# Altium schematic sheet BBB Headers.SchDoc: BBB Headers
size OrCAD E; DocumentNumber: LM-003; Revision: 3.0; SheetNumber: 4; SheetTotal: 11
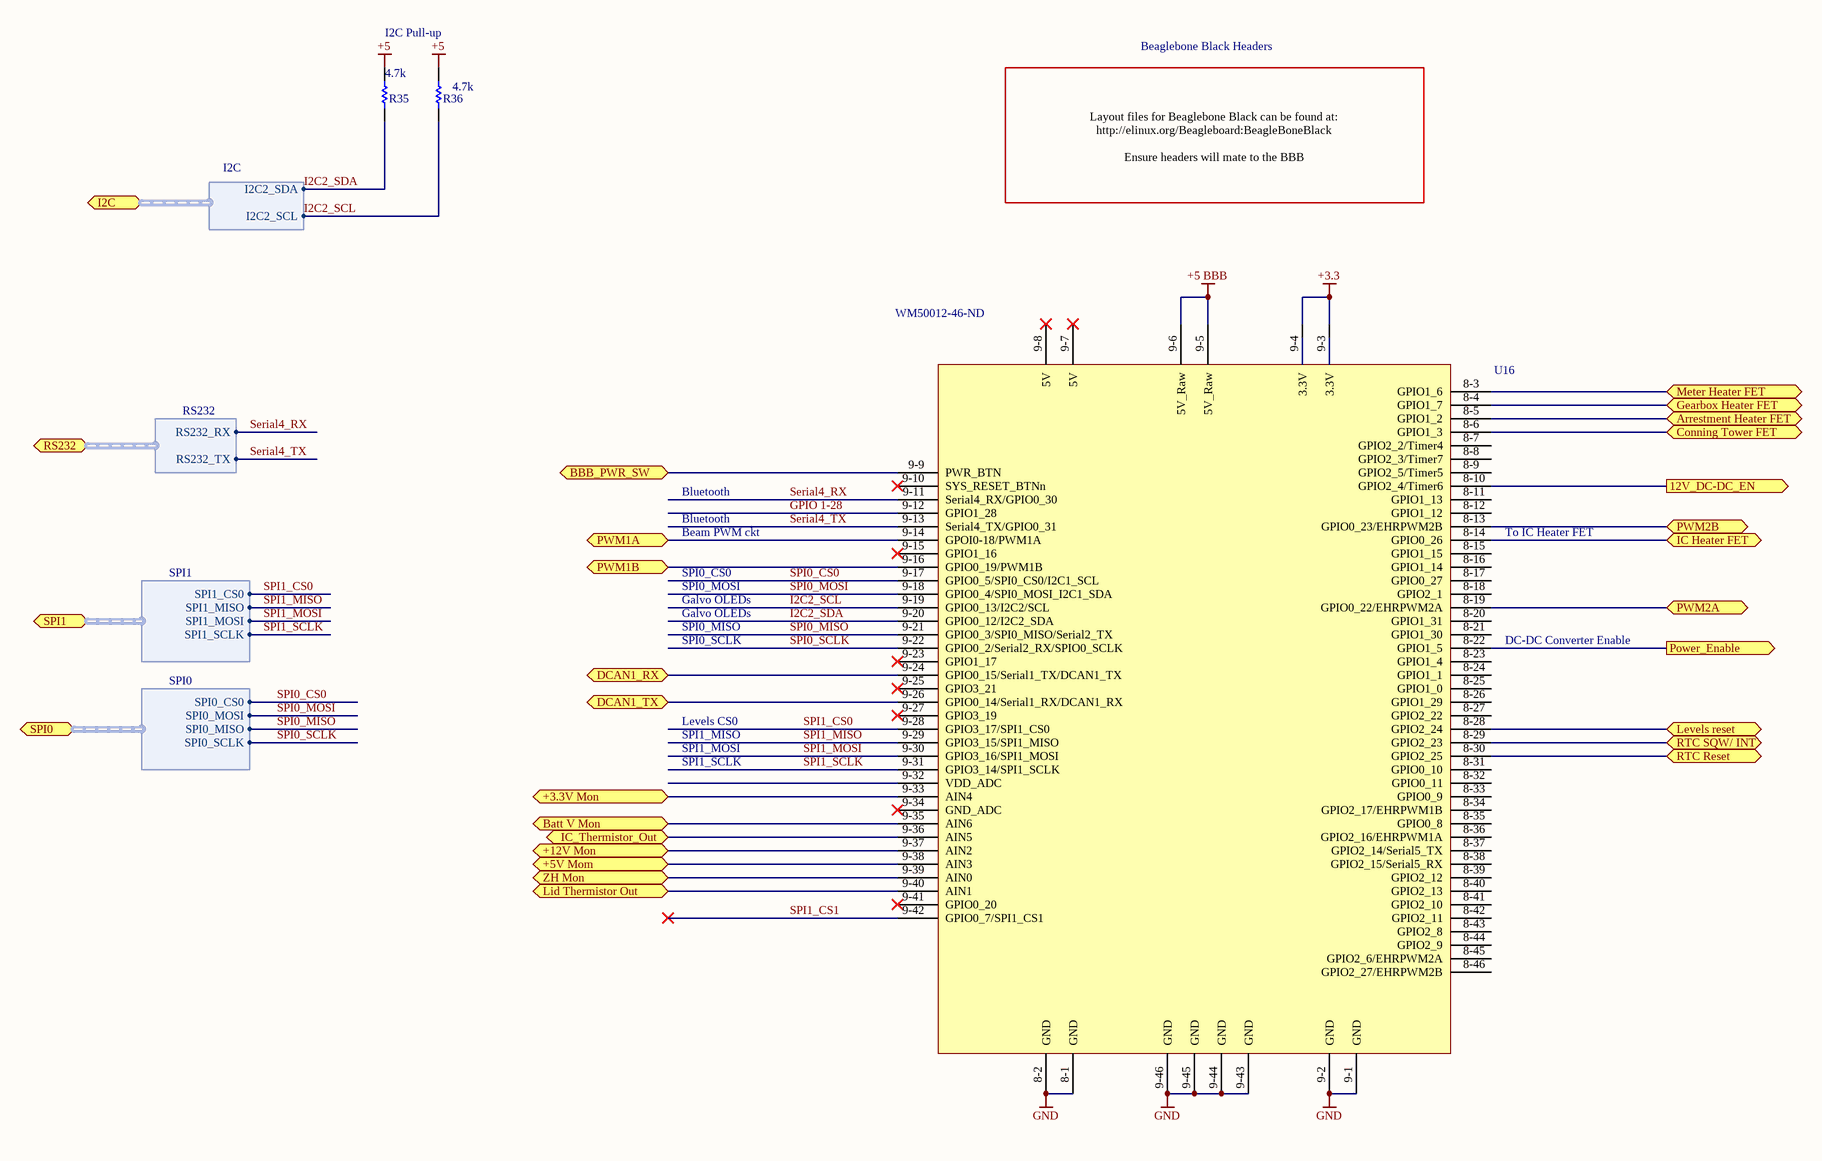
[diagram p0: BBB Headers.SchDoc]

## Parts
R35  Resistance (Ohms): 4.7k  [RESC0805(2012)_N]  (hidden comment: 3K74 0.125W 1% 0805 (2012 Metric)  SMD)
R36  Resistance (Ohms): 4.7k  [RESC0805(2012)_N]  (hidden comment: 3K74 0.125W 1% 0805 (2012 Metric)  SMD)
U16  Supplier Part Number 1: WM50012-46-ND  [Beaglebone Black]  (hidden comment: BBB)

## Ports
12V_DC-DC_EN (out), +3.3V Mon, +5V Mom, +12V Mon, Arrestment Heater FET, Batt V Mon, BBB_PWR_SW, Conning Tower FET, DCAN1_RX, DCAN1_TX, Gearbox Heater FET, I2C (harness I2C), IC Heater FET, IC_Thermistor_Out, Levels reset, Lid Thermistor Out, Meter Heater FET, Power_Enable (out), PWM1A, PWM1B, PWM2A, PWM2B, RS232 (harness RS232), RTC Reset, RTC SQW/ INT, SPI0 (harness SPI0), SPI1 (harness SPI1), ZH Mon

## Harnesses
RS232: RS232_RX, RS232_TX
I2C: I2C2_SDA, I2C2_SCL
SPI1: SPI1_CS0, SPI1_MISO, SPI1_MOSI, SPI1_SCLK
SPI0: SPI0_CS0, SPI0_MOSI, SPI0_MISO, SPI0_SCLK

## Nets
+3.3: U16.9-3(3.3V) U16.9-4(3.3V)
+5: R35.2 R36.2
+5 BBB: U16.9-5(5V_Raw) U16.9-6(5V_Raw)
GND: U16.8-1(GND) U16.8-2(GND) U16.9-1(GND) U16.9-2(GND) U16.9-43(GND) U16.9-44(GND) U16.9-45(GND) U16.9-46(GND)
12V_DC-DC_EN: U16.8-10(GPIO2_4/Timer6) ; port 12V_DC-DC_EN
+3.3V Mon: U16.9-33(AIN4) ; port +3.3V Mon
+5V Mom: U16.9-38(AIN3) ; port +5V Mom
+12V Mon: U16.9-37(AIN2) ; port +12V Mon
Arrestment Heater FET: U16.8-5(GPIO1_2) ; port Arrestment Heater FET
Batt V Mon: U16.9-35(AIN6) ; port Batt V Mon
BBB_PWR_SW: U16.9-9(PWR_BTN) ; port BBB_PWR_SW
Conning Tower FET: U16.8-6(GPIO1_3) ; port Conning Tower FET
DCAN1_RX: U16.9-24(GPIO0_15/Serial1_TX/DCAN1_TX) ; port DCAN1_RX
DCAN1_TX: U16.9-26(GPIO0_14/Serial1_RX/DCAN1_RX) ; port DCAN1_TX
Gearbox Heater FET: U16.8-4(GPIO1_7) ; port Gearbox Heater FET
GPIO 1-28: U16.9-12(GPIO1_28)
I2C2_SCL: R36.1 U16.9-19(GPIO0_13/I2C2/SCL) ; port I2C.I2C2_SCL
I2C2_SDA: R35.1 U16.9-20(GPIO0_12/I2C2_SDA) ; port I2C.I2C2_SDA
IC Heater FET: U16.8-14(GPIO0_26) ; port IC Heater FET
IC_Thermistor_Out: U16.9-36(AIN5) ; port IC_Thermistor_Out
Levels reset: U16.8-28(GPIO2_24) ; port Levels reset
Lid Thermistor Out: U16.9-40(AIN1) ; port Lid Thermistor Out
Meter Heater FET: U16.8-3(GPIO1_6) ; port Meter Heater FET
Power_Enable: U16.8-22(GPIO1_5) ; port Power_Enable
PWM1A: U16.9-14(GPOI0-18/PWM1A) ; port PWM1A
PWM1B: U16.9-16(GPIO0_19/PWM1B) ; port PWM1B
PWM2A: U16.8-19(GPIO0_22/EHRPWM2A) ; port PWM2A
PWM2B: U16.8-13(GPIO0_23/EHRPWM2B) ; port PWM2B
RTC Reset: U16.8-30(GPIO2_25) ; port RTC Reset
RTC SQW/ INT: U16.8-29(GPIO2_23) ; port RTC SQW/ INT
Serial4_RX: U16.9-11(Serial4_RX/GPIO0_30) ; port RS232.RS232_RX
Serial4_TX: U16.9-13(Serial4_TX/GPIO0_31) ; port RS232.RS232_TX
SPI0_CS0: U16.9-17(GPIO0_5/SPI0_CS0/I2C1_SCL) ; port SPI0.SPI0_CS0
SPI0_MISO: U16.9-21(GPIO0_3/SPI0_MISO/Serial2_TX) ; port SPI0.SPI0_MISO
SPI0_MOSI: U16.9-18(GPIO0_4/SPI0_MOSI_I2C1_SDA) ; port SPI0.SPI0_MOSI
SPI0_SCLK: U16.9-22(GPIO0_2/Serial2_RX/SPIO0_SCLK) ; port SPI0.SPI0_SCLK
SPI1_CS0: U16.9-28(GPIO3_17/SPI1_CS0) ; port SPI1.SPI1_CS0
SPI1_CS1: U16.9-42(GPIO0_7/SPI1_CS1)
SPI1_MISO: U16.9-29(GPIO3_15/SPI1_MISO) ; port SPI1.SPI1_MISO
SPI1_MOSI: U16.9-30(GPIO3_16/SPI1_MOSI) ; port SPI1.SPI1_MOSI
SPI1_SCLK: U16.9-31(GPIO3_14/SPI1_SCLK) ; port SPI1.SPI1_SCLK
ZH Mon: U16.9-39(AIN0) ; port ZH Mon

Not connected (* = marked no-connect by the designer): U16 8-7(GPIO2_2/Timer4) 8-8(GPIO2_3/Timer7) 8-9(GPIO2_5/Timer5) 8-11(GPIO1_13) 8-12(GPIO1_12) 8-15(GPIO1_15) 8-16(GPIO1_14) 8-17(GPIO0_27) 8-18(GPIO2_1) 8-20(GPIO1_31) 8-21(GPIO1_30) 8-23(GPIO1_4) 8-24(GPIO1_1) 8-25(GPIO1_0) 8-26(GPIO1_29) 8-27(GPIO2_22) 8-31(GPIO0_10) 8-32(GPIO0_11) 8-33(GPIO0_9) 8-34(GPIO2_17/EHRPWM1B) 8-35(GPIO0_8) 8-36(GPIO2_16/EHRPWM1A) 8-37(GPIO2_14/Serial5_TX) 8-38(GPIO2_15/Serial5_RX) 8-39(GPIO2_12) 8-40(GPIO2_13) 8-41(GPIO2_10) 8-42(GPIO2_11) 8-43(GPIO2_8) 8-44(GPIO2_9) 8-45(GPIO2_6/EHRPWM2A) 8-46(GPIO2_27/EHRPWM2B) 9-7(5V)* 9-8(5V)* 9-10(SYS_RESET_BTNn)* 9-15(GPIO1_16)* 9-23(GPIO1_17)* 9-25(GPIO3_21)* 9-27(GPIO3_19)* 9-32(VDD_ADC) 9-34(GND_ADC)* 9-41(GPIO0_20)*

## Notes on the sheet
- I2C Pull-up
- Beaglebone Black Headers
- Layout files for Beaglebone Black can be found at:
  http://elinux.org/Beagleboard:BeagleBoneBlack
  Ensure headers will mate to the BBB
- Bluetooth
- SPI0_CS0
- Beam PWM ckt
- To IC Heater FET
- Galvo OLEDs
- SPI0_MISO
- SPI0_MOSI
- SPI0_SCLK
- DC-DC Converter Enable
- SPI1_MISO
- SPI1_SCLK
- Levels CS0
- SPI1_MOSI
- Title
- Size:
- Date:
- File:
- Orcad E
- Number:
- Time:
- Revision:
- Sheet
- of

## Library data of the parts
R35 R36 = CMP-1013-00574-1: Manufacturer: Vishay Dale; Manufacturer Part Number: CRCW08054K70FKEA; Power (Watts): 0.125W, 1/8W; Temperature Coefficient: ±100ppm/°C; Supplier 1: Digi-Key; Supplier Part Number 1: 541-4.70KCDKR-ND; RoHS: RoHS Compliant; Category: Resistors; Stock 1: 0; Pricing 1: 1=0.1, 10=0.044, 100=0.0178, 1000=0.00802, 2500=0.00696 (USD); Packaging: Digi-Reel®; Part Status: Active; Tolerance: ±1%; Composition: Thick Film; Features: Automotive AEC-Q200; Operating Temperature: -55°C ~ 155°C; Package / Case: 0805 (2012 Metric); Supplier Device Package: 0805; Size / Dimension: 0.079" L x 0.049" W (2.00mm x 1.25mm); Height - Seated (Max): 0.020" (0.50mm); Failure Rate: -; ComponentLink1URL: http://www.vishay.com/docs/20035/dcrcwe3.pdf; ComponentLink1Description: http://www.vishay.com/docs/20035/dcrcwe3.pdf
U16 = Beaglebone_Black: Beaglebone Black; Manufacturer: Molex, LLC; Manufacturer Part Number: 0010897462; Connector Type: Header, Breakaway; Pitch - Mating: 0.100" (2.54mm); Style: Board to Board or Cable; Shrouding: Unshrouded; Number of Positions: 46; Number of Positions Loaded: All; Contact Length - Mating: 0.240" (6.10mm); Contact Length - Post: 0.107" (2.71mm); Overall Contact Length: 0.437" (11.10mm); Material Flammability Rating: UL94 V-0; Supplier 1: Digi-Key; RoHS: RoHS Compliant; Category: Connectors, Interconnects; Stock 1: 407; Pricing 1: 1=7.65, 10=7.336, 25=6.698, 50=6.379, 100=6.0601, 250=5.4222, 500=5.10324 (USD); Packaging: Bulk; Part Status: Active; Contact Type: Male Pin; Number of Rows: 2; Row Spacing - Mating: 0.100" (2.54mm); Mounting Type: Through Hole; Termination: Solder; Fastening Type: -; Insulation Height: 0.090" (2.29mm); Contact Shape: Square; Contact Finish - Mating: Gold; Contact Finish Thickness - Mating: 15µin (0.38µm); Contact Finish - Post: Tin; Contact Material: Copper Alloy; Insulation Material: Liquid Crystal Polymer (LCP), Glass Filled; Features: -; Operating Temperature: -; Ingress Protection: -; Insulation Color: Black; Current Rating: -; Voltage Rating: -; Mated Stacking Heights: -; Contact Finish Thickness - Post: 74.8µin (1.90µm); Applications: Automotive, General Purpose, Lighting, Medical, Telecommunications; ComponentLink1URL: http://www.molex.com/pdm_docs/sd/010897041_sd.pdf; ComponentLink1Description: http://www.molex.com/pdm_docs/sd/010897041_sd.pdf